# Altium project NodoFinalTesis.PrjPcb
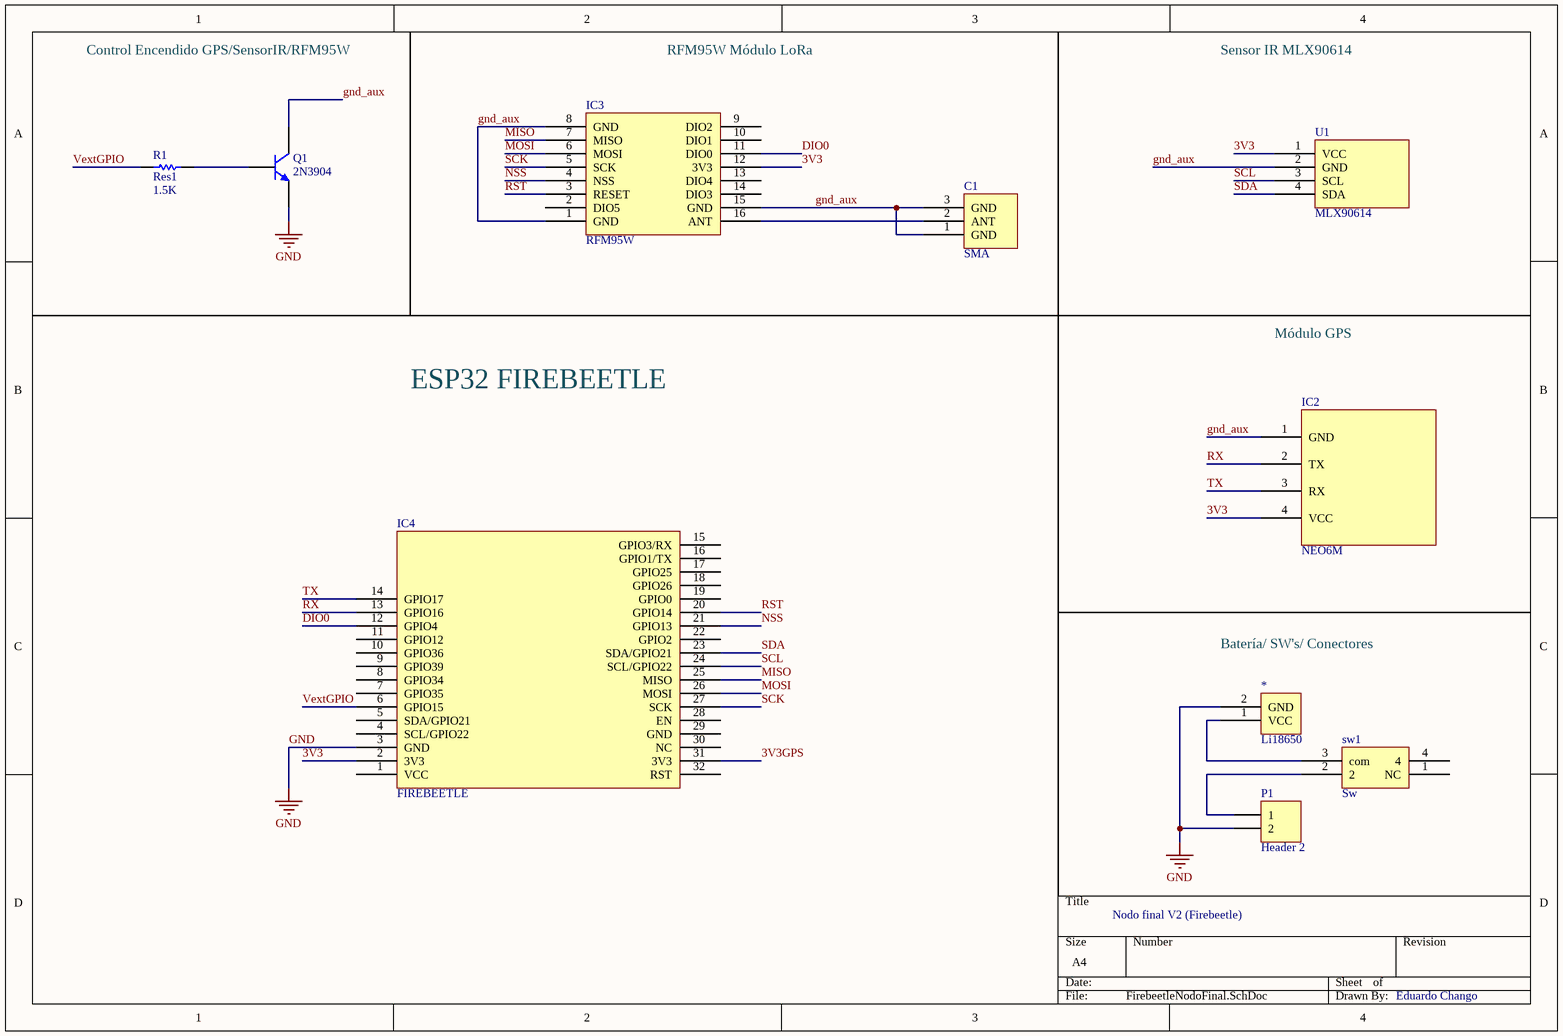
[diagram p0: FirebeetleNodoFinal.SchDoc]
1 sheet, 10 parts. Net scope: global (net labels, ports and power ports of the same name join across sheets).
Board file: FirebeetleNodoFinal.PcbDoc

## Sheet FirebeetleNodoFinal.SchDoc
size A4

### Parts
*  Li18650  [Li18650]
C1  SMA  [SMA]
IC2  NEO6M  [NEO6M]
IC3  RFM95W  [RFM95W]
IC4  FIREBEETLE  [FIREBEETLE]
P1  Header 2  [HDR1X2]
Q1  2N3904  [TO-92A]
R1  Res1  value 1.5K  [AXIAL-0.3]
sw1  Sw  [InterruptorSMD]
U1  MLX90614  [IRSENSOR]

### Nets
GND: *.2(GND) IC4.3(GND) P1.2 Q1.1(E)
3V3: IC2.4(VCC) IC3.12(3V3) IC4.2(3V3) U1.1(VCC)
3V3GPS: IC4.31(3V3)
DIO0: IC3.11(DIO0) IC4.12(GPIO4)
gnd_aux: C1.1(GND) C1.3(GND) IC2.1(GND) IC3.1(GND) IC3.8(GND) IC3.15(GND) Q1.3(C) U1.2(GND)
MISO: IC3.7(MISO) IC4.25(MISO)
MOSI: IC3.6(MOSI) IC4.26(MOSI)
NSS: IC3.4(NSS) IC4.21(GPIO13)
RST: IC3.3(RESET) IC4.20(GPIO14)
RX: IC2.2(TX) IC4.13(GPIO16)
SCK: IC3.5(SCK) IC4.27(SCK)
SCL: IC4.24(SCL/GPIO22) U1.3(SCL)
SDA: IC4.23(SDA/GPIO21) U1.4(SDA)
TX: IC2.3(RX) IC4.14(GPIO17)
VextGPIO: IC4.6(GPIO15) R1.2
Net*_1: *.1(VCC) sw1.3(com)
NetC1_2: C1.2(ANT) IC3.16(ANT)
NetP1_1: P1.1 sw1.2
NetQ1_2: Q1.2(B) R1.1

Not connected (* = marked no-connect by the designer): IC3 2(DIO5) 9(DIO2) 10(DIO1) 13(DIO4) 14(DIO3); IC4 1(VCC) 4(SCL/GPIO22) 5(SDA/GPIO21) 7(GPIO35) 8(GPIO34) 9(GPIO39) 10(GPIO36) 11(GPIO12) 15(GPIO3/RX) 16(GPIO1/TX) 17(GPIO25) 18(GPIO26) 19(GPIO0) 22(GPIO2) 28(EN) 29(GND) 30(NC) 32(RST); sw1 1(NC) 4

### Notes on the sheet
- Control Encendido GPS/SensorIR/RFM95W
- RFM95W Módulo LoRa
- Sensor IR MLX90614
- Módulo GPS
- ESP32 FIREBEETLE
- Batería/ SW's/ Conectores
- Nodo final V2 (Firebeetle)
- Eduardo Chango

### Library data of the parts
IC2 = NEO6M: GPS NEO6M
P1 = Header 2: Header, 2-Pin; LatestRevisionDate: 17-Jul-2002; LatestRevisionNote: Re-released for DXP Platform.; Publisher: Altium Limited
Q1 = 2N3904: NPN General Purpose Amplifier; Published: 8-Jun-2000; LatestRevisionDate: 15-Jan-2003; LatestRevisionNote: PCB Footprint 'BCY-W3/D4.7' replaced; DatasheetVersion: 1997; PackageVersion: Sep-1998; PackageReference: TO-92A; Publisher: Altium Limited; PackageDescription: TO, Flat Index; 3 In-Line, Axial Leads; Body Dia. 4.5mm; Leads 0.51 x 0.48 mm (max); ComponentLink1Description: Manufacturer Link; ComponentLink1URL: http://www.fairchildsemi.com/; ComponentLink2Description: Datasheet; ComponentLink2URL: http://www.fairchildsemi.com/ds/2N%2F2N3904.pdf
R1 = Res1: Resistor; Published: 8-Jun-2000; LatestRevisionDate: 17-Jul-2002; LatestRevisionNote: Re-released for DXP Platform.; PackageReference: AXIAL-0.3; Publisher: Altium Limited; PackageDescription: Axial Device, Thru-Hole; 2 Leads; 0.3 in Pin Spacing
U1 = MLX90614: iR SENSOR TEMPERATURA